# Altium schematic sheet Memory_SRAM.SchDoc
size B; Author: E. Sims; Organization: Let's Build Rockets Inc.; SheetNumber: 2; SheetTotal: 2
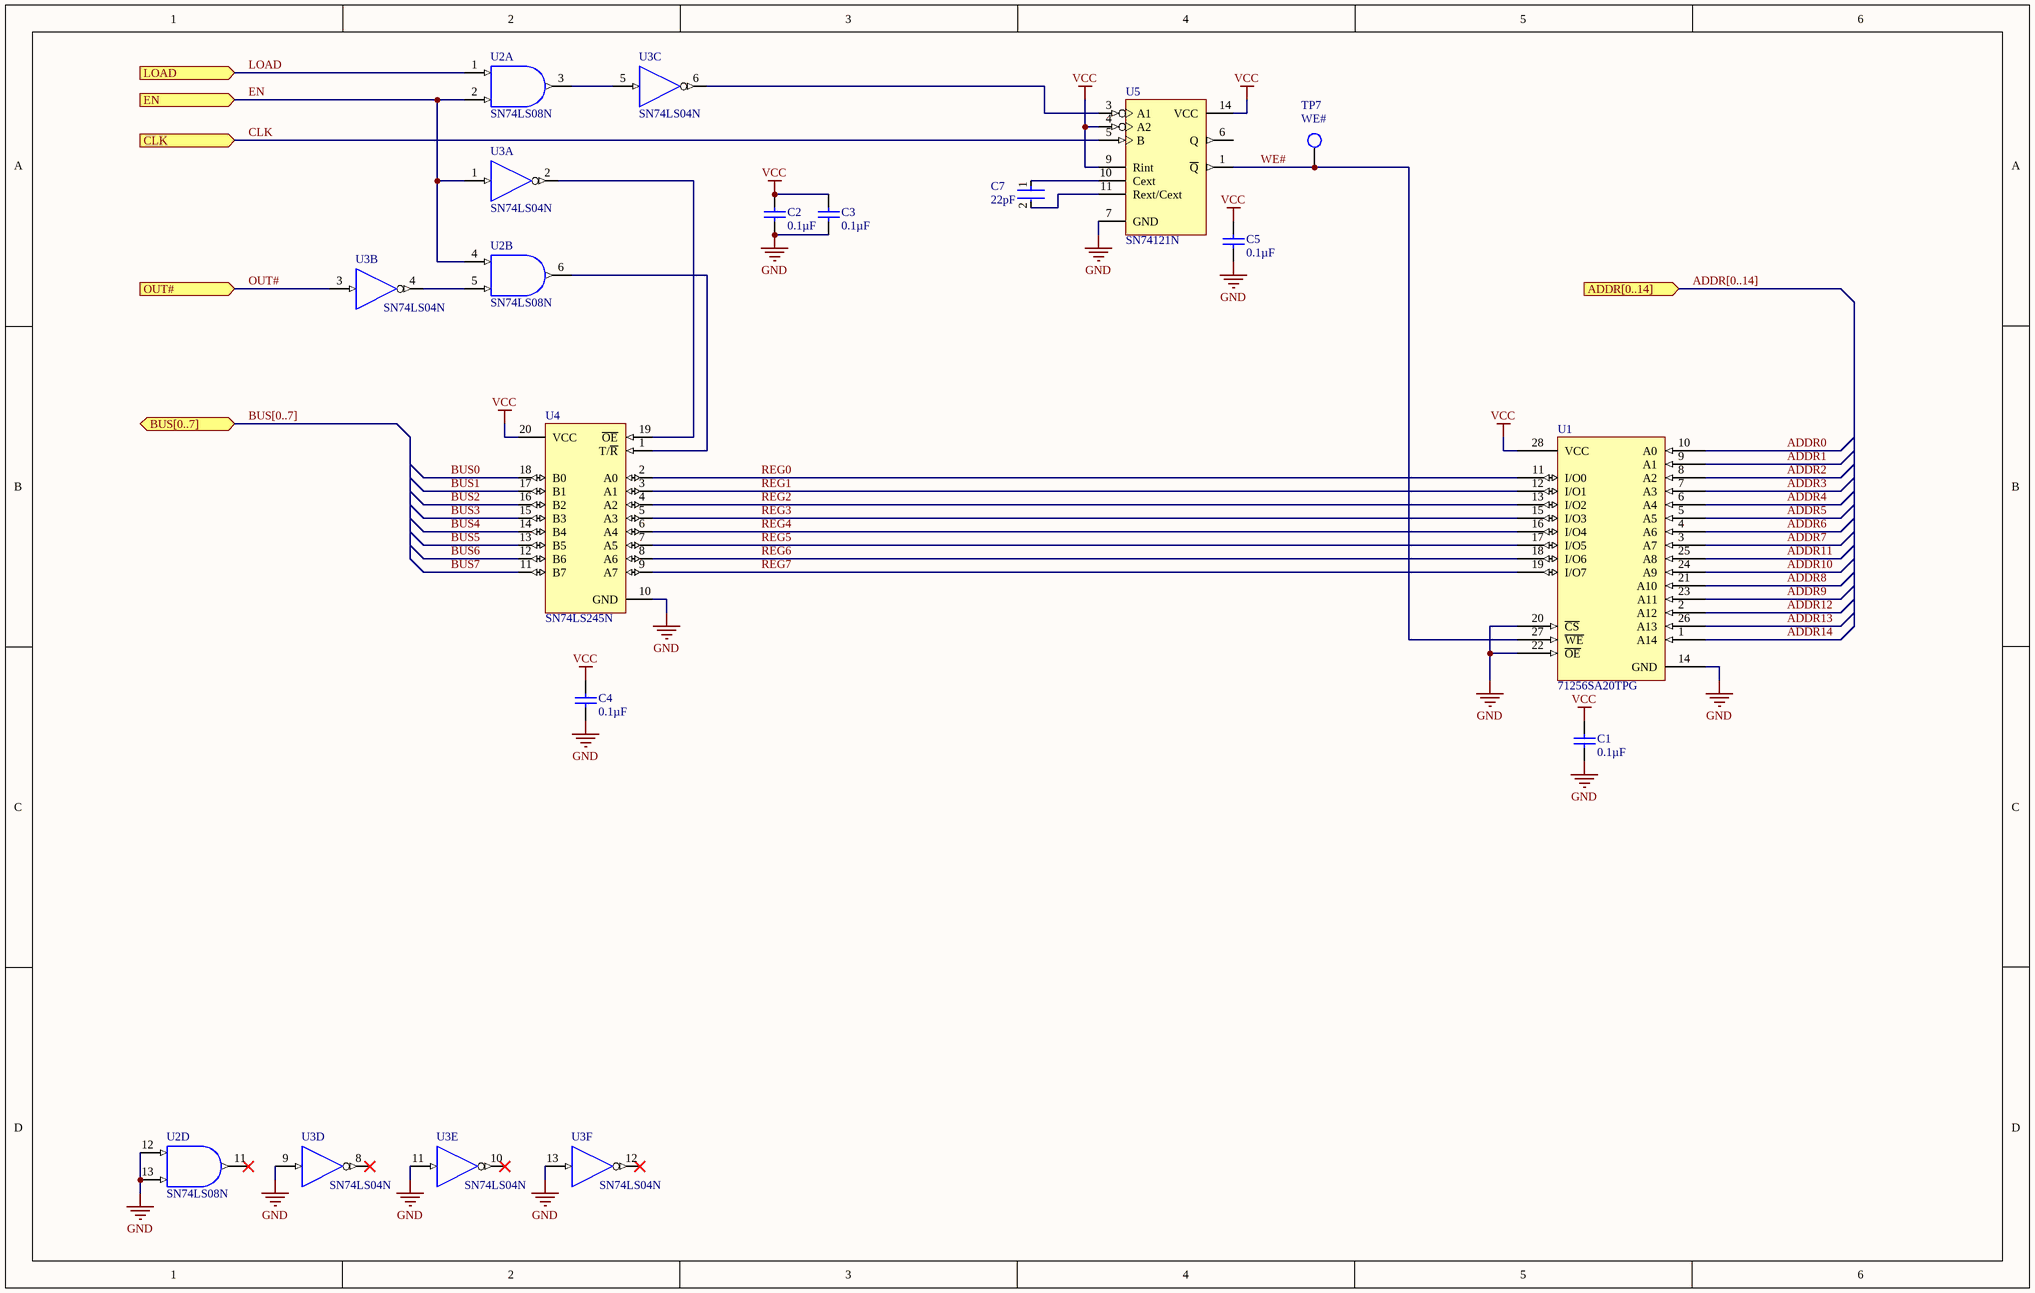
[diagram p0: Memory_SRAM.SchDoc]

## Parts
C1  Capacitance: 0.1µF  [VISH-K104K15X7RF5TL2]  (hidden comment: K104K15X7RF5TL2)
C2  Capacitance: 0.1µF  [VISH-K104K15X7RF5TL2]  (hidden comment: K104K15X7RF5TL2)
C3  Capacitance: 0.1µF  [VISH-K104K15X7RF5TL2]  (hidden comment: K104K15X7RF5TL2)
C4  Capacitance: 0.1µF  [VISH-K104K15X7RF5TL2]  (hidden comment: K104K15X7RF5TL2)
C5  Capacitance: 0.1µF  [VISH-K104K15X7RF5TL2]  (hidden comment: K104K15X7RF5TL2)
C7  Capacitance: 22pF  [FP-RDE0M1-MFG]  (hidden comment: RDE5C1H220J0M1H03A)
TP7  WE#  [KSTN-5011_V]  (no BOM)
U1  71256SA20TPG  [JT028]
U2  SN74LS08N  [N014]  (parts A,B,D of 4)
U3  SN74LS04N  [N014]  (parts A,B,C,D,E,F of 6)
U4  SN74LS245N  [N020]
U5  SN74121N  [N014]

## Ports
ADDR[0..14] (in), BUS[0..7] (bidir), CLK (in), EN (in), LOAD (in), OUT# (in)

## Nets
GND: C1.2 C2.2 C3.2 C4.2 C5.2 U1.14(GND) U1.20(~{CS}) U1.22(~{OE}) U2.7(GND) U2.12(A) U2.13(B) U3.7(GND) U3.9(A) U3.11(A) U3.13(A) U4.10(GND) U5.7(GND)
VCC: C1.1 C2.1 C3.1 C4.1 C5.1 U1.28(VCC) U2.14(VCC) U3.14(VCC) U4.20(VCC) U5.4(A2) U5.9(Rint) U5.14(VCC)
ADDR0: U1.10(A0)
ADDR1: U1.9(A1)
ADDR2: U1.8(A2)
ADDR3: U1.7(A3)
ADDR4: U1.6(A4)
ADDR5: U1.5(A5)
ADDR6: U1.4(A6)
ADDR7: U1.3(A7)
ADDR8: U1.21(A10)
ADDR9: U1.23(A11)
ADDR10: U1.24(A9)
ADDR11: U1.25(A8)
ADDR12: U1.2(A12)
ADDR13: U1.26(A13)
ADDR14: U1.1(A14)
BUS0: U4.18(B0)
BUS1: U4.17(B1)
BUS2: U4.16(B2)
BUS3: U4.15(B3)
BUS4: U4.14(B4)
BUS5: U4.13(B5)
BUS6: U4.12(B6)
BUS7: U4.11(B7)
CLK: U5.5(B) ; port CLK
EN: U2.2(B) U2.4(A) U3.1(A) ; port EN
LOAD: U2.1(A) ; port LOAD
OUT#: U3.3(A) ; port OUT#
REG0: U1.11(I/O0) U4.2(A0)
REG1: U1.12(I/O1) U4.3(A1)
REG2: U1.13(I/O2) U4.4(A2)
REG3: U1.15(I/O3) U4.5(A3)
REG4: U1.16(I/O4) U4.6(A4)
REG5: U1.17(I/O5) U4.7(A5)
REG6: U1.18(I/O6) U4.8(A6)
REG7: U1.19(I/O7) U4.9(A7)
WE#: TP7.1 U1.27(~{WE}) U5.1(~{Q})
NetC7_1: C7.1 U5.10(Cext)
NetC7_2: C7.2 U5.11(Rext/Cext)
NetU2_3: U2.3(Y) U3.5(A)
NetU2_5: U2.5(B) U3.4(Y)
NetU2_6: U2.6(Y) U4.1(T/~{R})
NetU3_2: U3.2(Y) U4.19(~{OE})
NetU3_6: U3.6(Y) U5.3(A1)

Not connected (* = marked no-connect by the designer): U2 11(Y)*; U3 8(Y)* 10(Y)* 12(Y)*; U5 6(Q)

## Buses and harness runs
bus ADDR[0..14] = port ADDR[0..14]
bus BUS[0..7] = port BUS[0..7]

## Notes on the sheet
- Let's Build Rocket's Inc. Modular Paylaod System Based on TMP-010 Rev
  For more information visit https://github.com/LetsBuildRockets/Modular-Payload-System
  This work is licensed under CC BY-NC 4.0. To view a copy of this license, visit https://creativecommons.org/licenses/by-nc/4.0
- Title
- Size:
- Date:
- Assembly Variant:
- B
- Number:
- Time:
- Revision:
- Sheet
- of
- Author:
- File:

## Library data of the parts
C1-C5 = CMP-2000-06508-1: Ceramic Capacitor, 100 nF, +/- 10%, 50 V, -55 to 125 degC, 2-Pin THD, RoHS, Tape and Reel; Manufacturer: Vishay; Other Names: BC1084CT; Catalog Drawings: Mono-KapSide2-15_5.58Mono-KapSide1_15; Temperature Coefficient: X7R; Voltage - Rated: 50V; Online Catalog: Mono-Kap™Series; Size / Dimension: 0.157"Lx0.098"W(4.00mmx2.50mm); Operating Temperature: -55°C~125°C; Family: CeramicCapacitors; Manufacturer URL: http://www.vishay.com/; Standard Package: 1; Thickness (Max): -; Ratings: -; Datasheet Version: 08/2013; Package Description: 2-Pin Through Hole Device, Body 4 x 2.6 mm; Mounting Type: ThroughHole; Features: -; Lead Spacing: 0.098"(2.50mm); Tolerance: ±10%; Category: Capacitors; Mounting Technology: ThroughHole; Lead Style: Straight; Datasheet URL: http://www.vishay.com/docs/45171/kseries.pdf; Applications: GeneralPurpose; Package / Case: Radial; Height - Seated (Max): 0.220"(5.58mm); Package Reference: K104K15X7RF5TL2; Series: Mono-Kap™K; Packaging: CutTape(CT)
C7 = CMP-06035-012716-1: Ceramic Capacitor 22pF ±5% 50V C0G Radial; Lead Diameter: 0.5mm; Packaging: Tape and Reel; Tolerance: 5%; Termination: Radial; Resistor Type: Ceramic; Mount: Through Hole; Case/Package: Radial; Voltage Rating: 50V; Min Operating Temperature: -55°C; Max Operating Temperature: 125°C; Lead Pitch: 0.197inch; Height - Seated (Max): 0.236inch; Height: 3.5mm; Dielectric: C0G; Width: 3.5mm; Voltage Rating (DC): 50V; Length: 0.157inch; Package Quantity: 2000
TP7 = TP
U2 = SN74LS08N: Quadruple 2-Input Positive-AND Gate; Published: 8-Jun-2000; LatestRevisionDate: 04-Mar-2005; LatestRevisionNote: Stylized 3D Model Added.; DatasheetVersion: Mar-1988; PackageVersion: Oct-1995; PackageReference: N014; Publisher: Altium Limited; PackageDescription: DIP; 14 Leads; Row Spacing 7.62 mm; Pitch 2.54 mm; ComponentLink1Description: Manufacturer Link; ComponentLink1URL: http://www.ti.com/; ComponentLink2Description: Datasheet; ComponentLink2URL: http://www-s.ti.com/sc/ds/SN74LS08.pdf
U3 = SN74LS04N: Hex Inverter; Published: 8-Jun-2000; LatestRevisionDate: 04-Mar-2005; LatestRevisionNote: Stylized 3D Model Added.; DatasheetVersion: Mar-1988; PackageVersion: Oct-1995; PackageReference: N014; Publisher: Altium Limited; PackageDescription: DIP; 14 Leads; Row Spacing 7.62 mm; Pitch 2.54 mm; ComponentLink1Description: Manufacturer Link; ComponentLink1URL: http://www.ti.com/; ComponentLink2Description: Datasheet; ComponentLink2URL: http://www-s.ti.com/sc/ds/sn74ls04.pdf
U4 = SN74LS245N: Octal Bus Transceiver with 3-State Outputs; Published: 8-Jun-2000; LatestRevisionDate: 04-Mar-2005; LatestRevisionNote: Stylized 3D Model Added.; DatasheetVersion: Mar-1988; PackageVersion: Oct-1995; PackageReference: N020; Publisher: Altium Limited; PackageDescription: DIP; 20 Leads; Row Spacing 7.62 mm; Pitch 2.54 mm; ComponentLink1Description: Manufacturer Link; ComponentLink1URL: http://www.ti.com/; ComponentLink2Description: Datasheet; ComponentLink2URL: http://www-s.ti.com/sc/ds/sn74ls245.pdf
U5 = SN74121N: Monostable Multivibrator with Schmitt-Trigger Inputs; Note: Pins No 2,8,12 and 13 are not connected and not drawn; Published: 8-Jun-2000; LatestRevisionDate: 04-Mar-2005; LatestRevisionNote: Stylized 3D Model Added.; DatasheetVersion: Mar-1988; PackageVersion: Oct-1995; PackageReference: N014; Publisher: Altium Limited; PackageDescription: DIP; 14 Leads; Row Spacing 7.62 mm; Pitch 2.54 mm; ComponentLink1Description: Manufacturer Link; ComponentLink1URL: http://www.ti.com/; ComponentLink2Description: Datasheet; ComponentLink2URL: http://www-s.ti.com/sc/ds/sn74121.pdf